# Altium project PCB_Study.PrjPCB
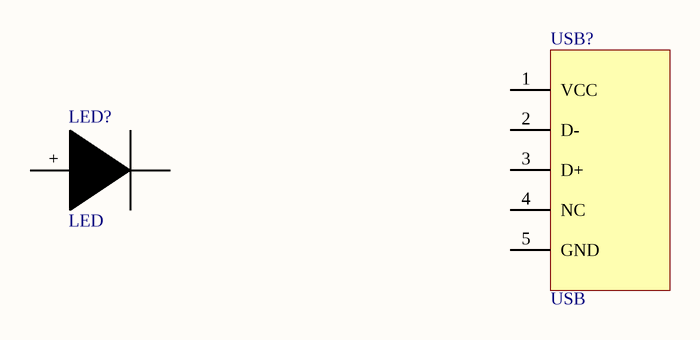
[diagram p0: PCB_Study.SchDoc]
1 sheet, 2 parts. Net scope: global (net labels, ports and power ports of the same name join across sheets).

## Sheet PCB_Study.SchDoc
size A4

### Parts
LED?  LED
USB?  USB

### Nets

Not connected (* = marked no-connect by the designer): LED? + -; USB? 1(VCC) 2(D-) 3(D+) 4(NC) 5(GND)

### Library data of the parts
USB? = MiniUSB